# EAGLE design stepper-motor-driver (EAGLE 5.10)
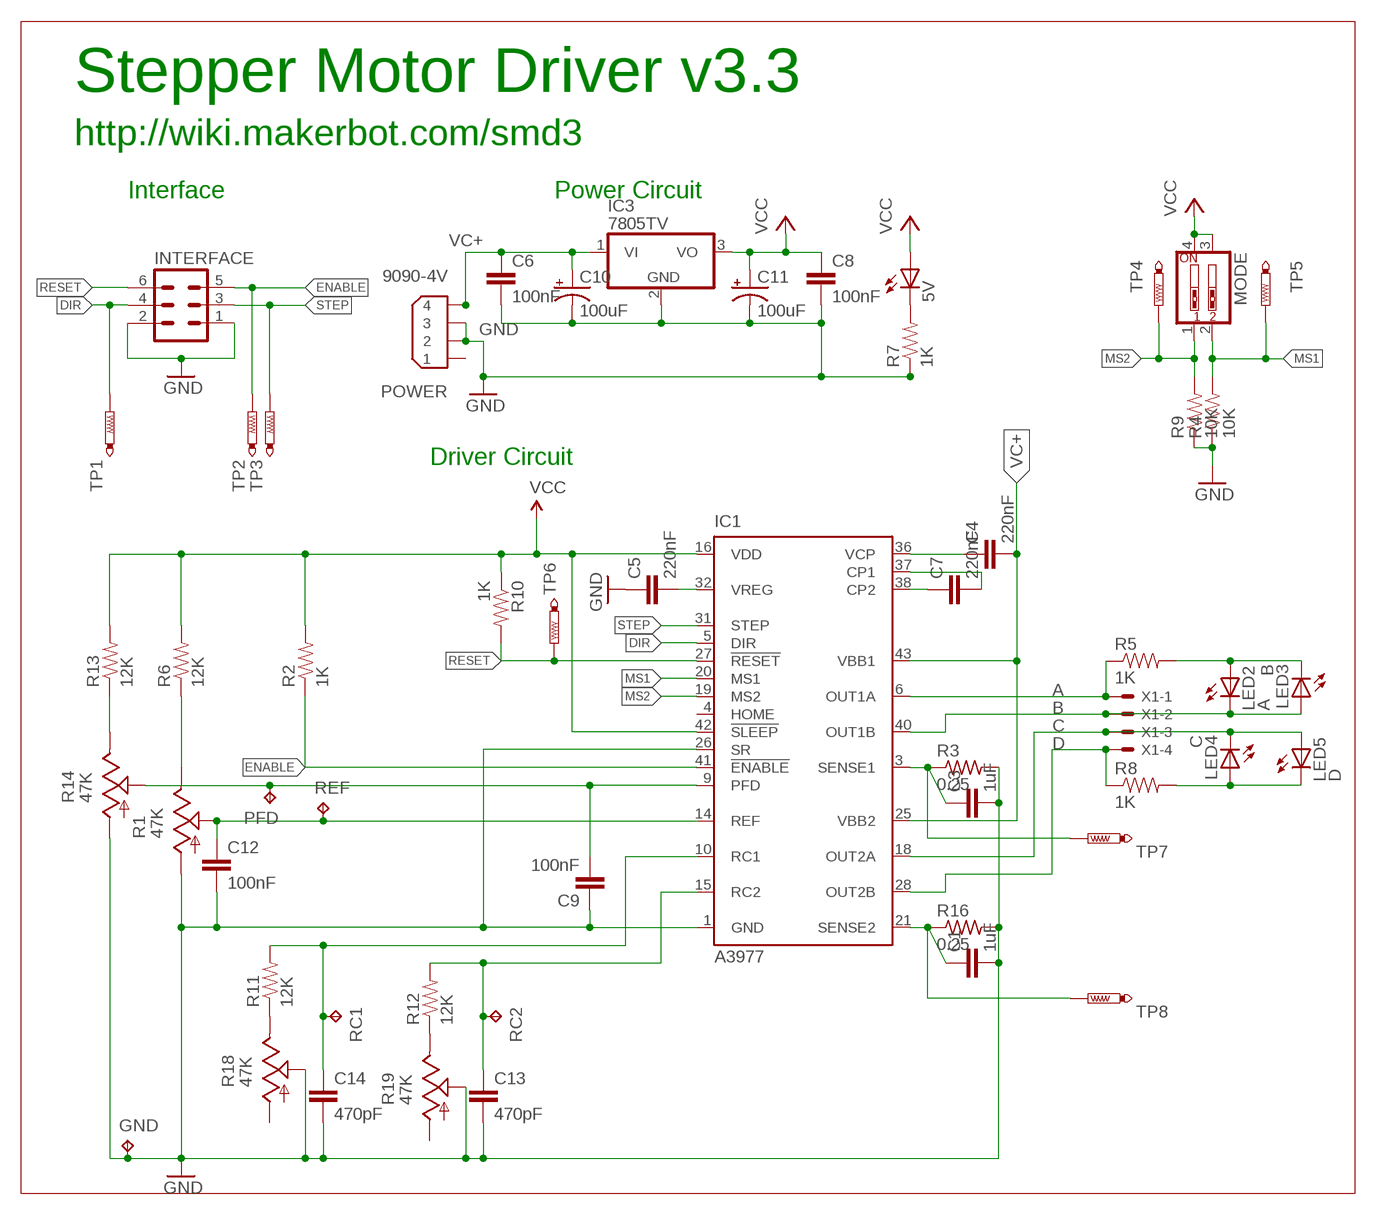
[diagram p0: schematic, sheet 1]

## Parts
5V  LED0805  [LED-0805]
C1  1uF  CAP0805  [0805]
C3  1uF  CAP0805  [0805]
C4  220nF  CAP0805  [0805]
C5  220nF  CAP0805  [0805]
C6  100nF  CAP0805  [0805]
C7  220nF  CAP0805  [0805]
C8  100nF  CAP0805  [0805]
C9  100nF  CAP0805  [0805]
C10  100uF  CPOL-USE3.5-8  [E3,5-8]
C11  100uF  CPOL-USE3.5-8  [E3,5-8]
C12  100nF  CAP0805  [0805]
C13  470pF  CAP0805  [0805]
C14  470pF  CAP0805  [0805]
GND  TPPAD1-13  [P1-13]
IC1  A3977  [PLCC44]
IC3  7805TV  [TO220V]
INTERFACE  ML6  [ML6]
LED2  A  LED0805  [LED-0805]
LED3  B  LED0805  [LED-0805]
LED4  C  LED0805  [LED-0805]
LED5  D  LED0805  [LED-0805]
MODE  SW_DIP-2  [EDG-02]
PFD  TPPAD1-13  [P1-13]
POWER  9090-4V  [9090-4V]
R1  47K  TRIM_US-B25P  [B25P]
R2  1K  RESISTOR  [0805]
R3  0.25  R-US_R2512  [R2512]
R4  10K  RESISTOR  [0805]
R5  1K  RESISTOR  [0805]
R6  12K  RESISTOR  [0805]
R7  1K  RESISTOR  [0805]
R8  1K  RESISTOR  [0805]
R9  10K  RESISTOR  [0805]
R10  1K  RESISTOR  [0805]
R11  12K  RESISTOR  [0805]
R12  12K  RESISTOR  [0805]
R13  12K  RESISTOR  [0805]
R14  47K  TRIM_US-B25P  [B25P]
R16  0.25  R-US_R2512  [R2512]
R18  47K  TRIM_US-B25P  [B25P]
R19  47K  TRIM_US-B25P  [B25P]
RC1  TPPAD1-13  [P1-13]
RC2  TPPAD1-13  [P1-13]
REF  TPPAD1-13  [P1-13]
TP1  PTR1TP09R  [TP09R]
TP2  PTR1TP09R  [TP09R]
TP3  PTR1TP09R  [TP09R]
TP4  PTR1TP09R  [TP09R]
TP5  PTR1TP09R  [TP09R]
TP6  PTR1TP09R  [TP09R]
TP7  PTR1TP09R  [TP09R]
TP8  PTR1TP09R  [TP09R]
X1  KK-156-4  [KK-156-4]

## Nets
A [Power]: IC1.6(OUT1A) R5.1 X1.1
B [Power]: IC1.40(OUT1B) LED2.C LED3.A X1.2
C [Power]: IC1.18(OUT2A) LED4.C LED5.A X1.3
D [Power]: IC1.28(OUT2B) R8.1 X1.4
DIR: IC1.5(DIR) INTERFACE.4 TP1.TP
ENABLE: IC1.41(!ENABLE) INTERFACE.5 R2.1 TP2.TP
GND [Power]: C1.2 C3.2 C5.1 C6.2 C8.2 C9.1 C10.- C11.- C12.2 C13.2 C14.2 GND.TP IC1.1(GND) IC1.26(SR) IC3.2(GND) INTERFACE.1 INTERFACE.2 POWER.2 POWER.3 R1.A R3.2 R4.1 R7.1 R9.1 R14.A R16.2 R18.S R19.S
MS1: IC1.20(MS1) MODE.2 R4.2 TP5.TP
MS2: IC1.19(MS2) MODE.1 R9.2 TP4.TP
N$1: C3.1 IC1.3(SENSE1) R3.1 TP7.TP
N$2: C1.1 IC1.21(SENSE2) R16.1 TP8.TP
N$3: C9.2 IC1.9(PFD) PFD.TP R14.S
N$4: C14.1 IC1.10(RC1) R11.2 RC1.TP
N$5: C13.1 IC1.15(RC2) R12.2 RC2.TP
N$6: R1.E R6.1
N$7: C5.2 IC1.32(VREG)
N$8: 5V.C R7.2
N$9: R13.1 R14.E
N$10 [Power]: LED2.A LED3.C R5.2
N$11: C7.1 IC1.38(CP2)
N$12 [Power]: LED4.A LED5.C R8.2
N$13: C12.1 IC1.14(REF) R1.S REF.TP
N$15: C7.2 IC1.37(CP1)
N$16: C4.1 IC1.36(VCP)
N$18: R11.1 R18.E
N$19: R12.1 R19.E
RESET: IC1.27(!RESET) INTERFACE.6 R10.2 TP6.TP
STEP: IC1.31(STEP) INTERFACE.3 TP3.TP
VC+ [Power]: C4.2 C6.1 C10.+ IC1.25(VBB2) IC1.43(VBB1) IC3.1(VI) POWER.4
VCC: 5V.A C8.1 C11.+ IC1.16(VDD) IC1.42(!SLEEP) IC3.3(VO) MODE.3 MODE.4 R2.2 R6.2 R10.1 R13.2
Unconnected: IC1.4(HOME) POWER.1 R18.A R19.A

## Notes on the sheet
- Stepper Motor Driver v3.3
- http://wiki.makerbot.com/smd3
- Interface | Power Circuit
- Driver Circuit

## Power pins joined to a net without a drawn wire
GND: IC1.2(GND) IC1.11(GND) IC1.12(GND) IC1.13(GND) IC1.22(GND) IC1.23(GND) IC1.24(GND) IC1.33(GND) IC1.34(GND) IC1.35(GND) IC1.44(GND)

## Library data of the parts
5V LED2-LED5 = SparkFun:LED: LEDs Standard schematic elements and footprints for 5mm, 3mm, 1206, and 0603 sized LEDs. 5mm - Spark Fun Electronics SKU : COM-00529 (and others)
C1 C3-C9 C12-C14 = SparkFun:CAP: Capacitor Standard 0603 ceramic capacitor, and 0.1" leaded capacitor.
C10 C11 = rcl:CPOL-US: POLARIZED CAPACITOR, American symbol
GND PFD RC1 RC2 REF = testpad:TP: Test pad
IC1 = linear:A3977: MICROSTEPPING DMOS DRIVER WITH TRANSLATOR Source: http://allegromicro.com/datafile/3977.pdf
IC3 = linear:78*: Positive VOLTAGE REGULATOR Source: http://cache.national.com/ds/LM/LM78L05.pdf http://www.fairchildsemi.com/ds/LM/LM7805.pdf
INTERFACE = con-ml:ML6: HARTING
MODE = special:SW_DIP-2: DIP SWITCH
POWER = con-thomas-betts:9090-4: Disk Drive Power four position Source: Thomas & Betts Electronic Interconnects Eiropean Edition 1998
R1 R14 R18 R19 = reprap:TRIM_US-: POTENTIOMETER
R2 R4-R13 = SparkFun:RESISTOR: Resistor Basic schematic elements and footprints for 0603, 1206, and PTH 1/10th watt (small) resistors.
R3 R16 = rcl:R-US_: RESISTOR, American symbol
TP1-TP8 = testpad:PTR1: TEST PIN
X1 = con-molex:KK-156-4: KK 156 HEADER Source: http://www.molex.com/pdm_docs/sd/026604100_sd.pdf

## Net classes
0 default: width 0.381 mm
1 Power: width 0.635 mm, drill 0.381 mm, clearance 0.508 mm
2 Trunk: width 1.676 mm, clearance 0.508 mm

## Board
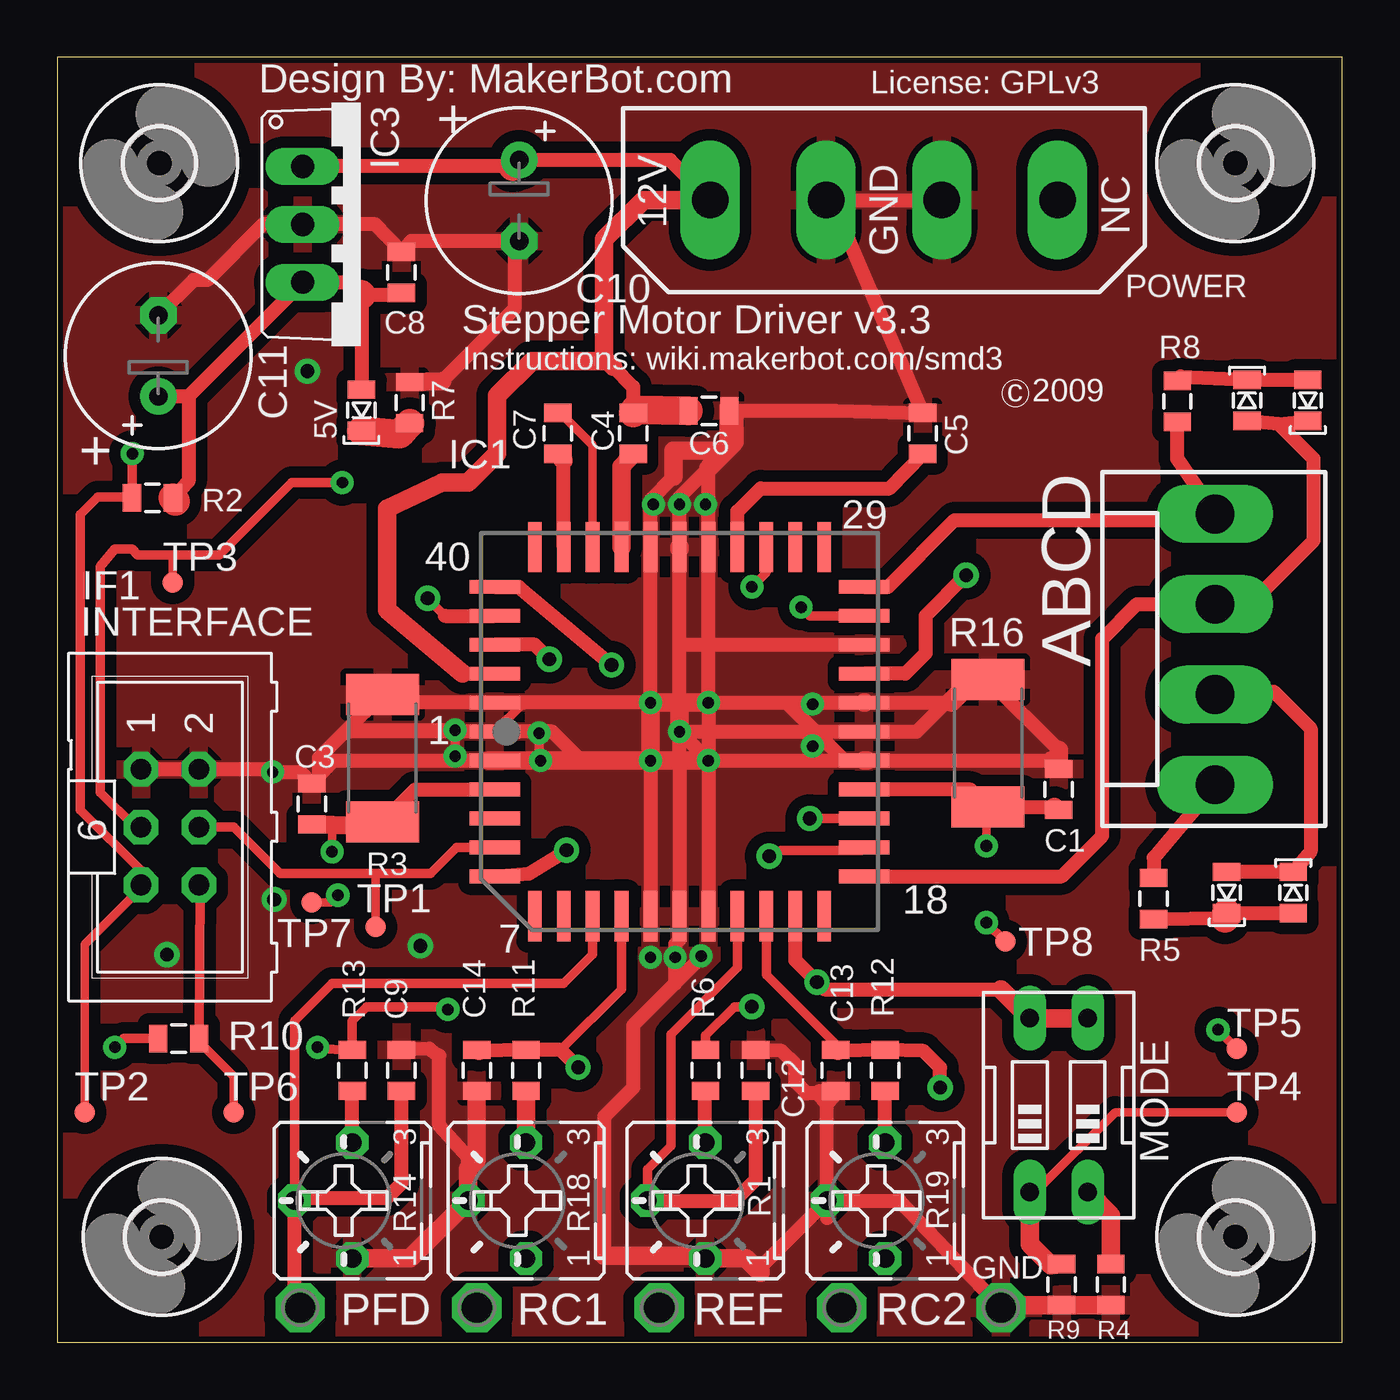
[diagram p1: board, top side]
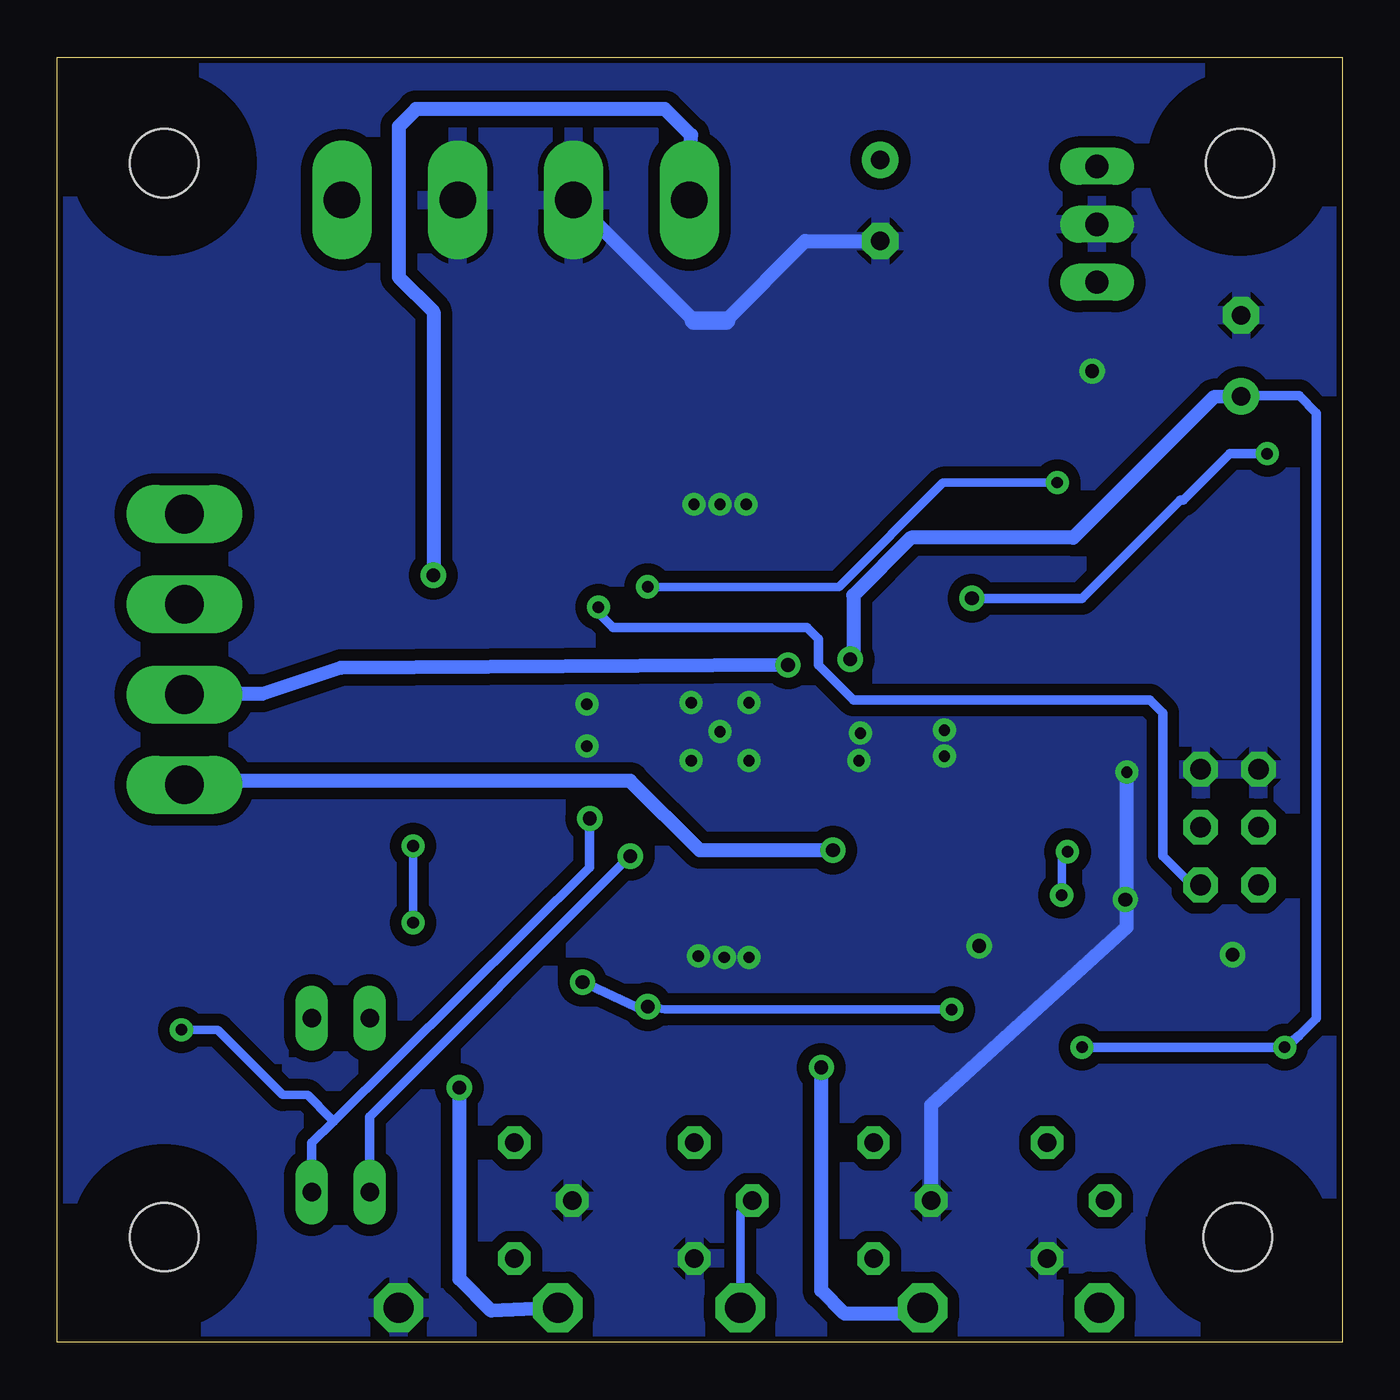
[diagram p2: board, bottom side, seen from below]

Size 56.39 x 56.39 mm. Coordinates in mm from the lower left corner, seen from the top.
Outline: 0,0 56.39,0 56.39,56.39 0,56.39 0,0
Copper layers (1*16): Top 0.035mm / dielectric 1.5mm / Bottom 0.035mm
Design rules "SparkFun": minimum track width 8mil, minimum drill 20mil, track to track 8mil, track to pad 8mil, pad to pad 8mil, via to via 8mil, smd to smd 8mil, copper to edge 10mil, drill to drill 8mil, minimum pad ring 12mil, minimum via ring 10mil, stop-mask expansion 4mil, vias tented up to drill 25mil, thermal gap 10mil

### Footprints (pad centres in the part's own frame; a part is rotated, then mirrored left to right if it is on the bottom)
LED-0805 = smd 1.2 x 0.8: A 0,-0.9; C 0,0.9
0805 = smd 0.8 x 1.2: 1 -0.9,0; 2 0.9,0
E3,5-8 = drill 0.813 pad 1.6 round: + -1.778,0 | drill 0.813 pad 1.6 octagon: - 1.778,0
P1-13 = drill 1.321 pad 2.159 octagon: TP 0,0
PLCC44 = smd 0.6 x 2.2: 1 0,8.1; 2 -1.27,8.1; 3 -2.54,8.1; 4 -3.81,8.1; 5 -5.08,8.1; 6 -6.35,8.1; 18 -6.35,-8.1; 19 -5.08,-8.1; 20 -3.81,-8.1; 21 -2.54,-8.1; 22 -1.27,-8.1; 23 0,-8.1; 24 1.27,-8.1; 25 2.54,-8.1; 26 3.81,-8.1; 27 5.08,-8.1; 28 6.35,-8.1; 40 6.35,8.1; 41 5.08,8.1; 42 3.81,8.1; 43 2.54,8.1; 44 1.27,8.1 | smd 2.2 x 0.6: 7 -8.1,6.35; 8 -8.1,5.08; 9 -8.1,3.81; 10 -8.1,2.54; 11 -8.1,1.27; 12 -8.1,0; 13 -8.1,-1.27; 14 -8.1,-2.54; 15 -8.1,-3.81; 16 -8.1,-5.08; 17 -8.1,-6.35; 29 8.1,-6.35; 30 8.1,-5.08; 31 8.1,-3.81; 32 8.1,-2.54; 33 8.1,-1.27; 34 8.1,0; 35 8.1,1.27; 36 8.1,2.54; 37 8.1,3.81; 38 8.1,5.08; 39 8.1,6.35
TO220V = drill 1.016 long: 1 -2.54,-2.54; 2 0,-2.54; 3 2.54,-2.54
ML6 = drill 0.914 octagon: 1 -2.54,-1.27; 2 -2.54,1.27; 3 0,-1.27; 4 0,1.27; 5 2.54,-1.27; 6 2.54,1.27
EDG-02 = drill 0.813 long: 1 -1.27,-3.81; 2 1.27,-3.81; 3 1.27,3.81; 4 -1.27,3.81
9090-4V = drill 1.6 pad 2.6 long: 1 -7.62,0; 2 -2.54,0; 3 2.54,0; 4 7.62,0
B25P = drill 0.813 octagon: A -2.54,0; E 2.54,0; S 0,2.54
R2512 = smd 1.8 x 3.2: 1 -2.8,0; 2 2.8,0
TP09R = smd 0.9 x 0.9: TP 0,0
3,0 = hole 3: 0,0
KK-156-4 = drill 1.7 pad 2.184 long: 1 -5.94,0; 2 -1.98,0; 3 1.98,0; 4 5.94,0

### Placement (x,y rotation side)
5V  13.36,40.9 180 top
C1  43.94,24.26 90 top
C3  11.18,23.62 90 top
C4  25.27,39.88 90 top
C5  37.97,39.88 270 top
C6  28.6,40.87 0 top
C7  21.97,39.88 90 top
C8  15.11,46.94 90 top
C9  15.11,11.94 270 top
C10  20.27,50.09 270 top
C11  4.45,43.28 90 top
C12  30.65,11.94 90 top
C13  34.16,11.94 270 top
C14  18.41,11.94 270 top
GND  41.4,1.52 0 top
IC1  27.3,26.8 90 top
IC3  13.31,49.05 270 top
INTERFACE  4.95,22.61 270 top
LED2  54.23,19.74 0 top
LED3  51.31,19.74 180 top
LED4  54.86,41.33 180 top
LED5  52.2,41.33 0 top
MODE  43.94,10.41 0 top
PFD  10.67,1.52 0 top
POWER  36.27,50.11 180 top
R1  28.43,6.22 90 top
R2  4.19,37.06 0 top
R3  14.27,25.63 90 top
R4  46.23,2.54 90 top
R5  48.1,19.47 270 top
R6  28.45,11.94 90 top
R7  15.47,41.22 270 top
R8  49.14,41.29 90 top
R9  44.07,2.54 90 top
R10  5.33,13.34 0 top
R11  20.57,11.94 90 top
R12  36.32,11.94 90 top
R13  12.95,11.94 90 top
R14  12.95,6.22 90 top
R16  40.84,26.29 90 top
R18  20.57,6.22 90 top
R19  36.32,6.22 90 top
RC1  18.41,1.52 0 top
RC2  34.42,1.52 0 top
REF  26.42,1.52 0 top
TP1  13.97,18.22 0 top
TP2  1.21,10.1 0 top
TP3  5.08,33.34 0 top
TP4  51.75,10.1 0 top
TP5  51.75,12.89 0 top
TP6  7.75,10.1 0 top
TP7  11.18,19.3 0 top
TP8  41.59,17.59 0 top
U$1  [3,0]  4.49,51.73 0 top
U$2  [3,0]  51.69,51.73 0 top
U$3  [3,0]  4.59,4.63 0 top
U$4  [3,0]  51.69,4.63 0 top
X1  50.8,30.4 90 top

### Tracks (layer width: path | path; a pad name or v marks a point on that pad's centre or on a via)
A  (via drill 0.6)
  Top 0.61: R5.1 48.1,21.26 X1.1 | IC1.6 20.7,20.57 v22.35,21.59
  Bottom 0.61: v22.35,21.59 28.19,21.59 31.24,24.64 50.63,24.64 X1.1
B  (via drill 0.6)
  Top 0.61: LED3.A LED2.C 54.99,21.55 54.99,26.92 53.36,28.55 X1.2 | IC1.40 20.26,33.15 v24.32,29.72
  Bottom 0.61: v24.32,29.72 43.94,29.59 47.37,28.45 50.78,28.45
  Bottom 0.813: 50.78,28.45 X1.2
C
  Top 0.61: 53.59,40.28 LED5.A | 53.59,40.28 LED4.C | X1.3 52.45,32.51 55.12,35.18 55.12,38.75 53.59,40.28 | IC1.18 44.07,20.45 45.85,22.23 45.85,30.86 47.37,32.38 X1.3
  Top 0.813: X1.3
D
  Top 0.61: R8.1 49.14,38.77 X1.4 | IC1.28 36.45,33.15 39.37,36.07 50.52,36.07
  Top 0.813: 50.52,36.07 X1.4
DIR
  Top 0.381: 13.97,20.57 TP1.TP
  Top 0.406: INTERFACE.4 7.75,22.61 9.78,20.57 13.97,20.57 16.38,20.57 17.53,21.72 IC1.5
ENABLE  (via drill 0.5, 0.6)
  Top 0.381: TP2.TP 1.21,17.46 3.62,19.88 INTERFACE.5
  Top 0.406: INTERFACE.5 3.68,20.7 1.02,23.37 1.02,36.32 1.78,37.08 3.32,37.08 R2.1 3.3,37.1 v3.3,38.99 | v16.26,32.64 17.02,31.88
  Top 0.61: 17.02,31.88 IC1.41
  Bottom 0.406: v16.26,32.64 11.43,32.64 7.11,36.96 6.99,36.96 4.95,38.99 v3.3,38.99
GND  (via drill 0.5, 0.6, 0.6 pad 0)
  Top 0.406: v9.46,25.02 9.34,25.15 | 20.45,28.07 20.45,28.04 IC1.1 | 21.72,26.8 21.21,26.8 v21.14,26.73 21.14,25.59 v21.21,25.53 | v17.46,26.86 v17.46,25.72
  Top 0.61: C11.- 5.99,46.61 6.6,46.61 9.04,49.05 IC3.2 13.96,49.05 C8.2 15.54,48.31 C10.- 20.07,48.11 20.07,45.34 16.9,42.17 | R19.S 33.78,5.46 | R19.S 36.96,6.22 GND.TP | R19.S 33.78,10.61 | POWER.3 POWER.2 | 27.3,25.65 27.3,26.67 27.18,26.8 | 27.3,28.07 27.3,30.61 | v26.04,28.07 IC1.35 26.04,36.96 27.05,37.97 | v26.04,25.53 IC1.11 | v28.57,25.53 v28.57,28.07 IC1.33 28.57,38.35 | v28.57,25.53 IC1.13 | v26.04,28.07 20.45,28.07 IC1.44 14.64,28.07 | 27.43,26.8 IC1.23 37.72,26.8 40.01,29.09 | 27.3,30.61 IC1.26 | R16.2 43.94,25.99 | R3.2 12.64,26.8 IC1.1 21.72,26.8 22.99,25.53 | 34.16,49.68 C5.1 34.16,40.87 C6.2 | C9.1 16.32,12.89 16.76,12.57 16.76,9.53 18.03,8.13 18.03,6.73 | C12.2 31.79,12.79 32.38,12.19 32.38,11.43 32.89,10.92 33.47,10.92 | 30.86,3.3 R19.S | v28.57,25.53 v27.3,26.8 | C3.2 12.13,25.53 18.92,25.53 19.3,25.53 | 39.24,28.07 35.43,28.07 32,28.07 | 43.62,25.53 35.56,25.53 34.54,25.53 | 29.46,39.24 27.3,37.08 27.3,34.8 27.3,30.61 | v26.04,28.07 32,28.07 | v21.21,25.53 27.3,25.53 IC1.12 27.3,17.65 27.11,17.46 v27.11,16.89 27.11,15.75 | 27.43,25.53 34.54,25.53 | 32,28.07 34.54,25.53 | 24,3.81 24,9.91 25.27,11.18 25.27,13.91 27.11,15.75 | INTERFACE.1 INTERFACE.2 9.34,25.15 | v17.46,26.86 12.7,26.86 11.49,25.65 11.49,24.84 C3.2 | v9.46,25.02 10.68,25.02 C3.2 | v28.26,16.95 28.26,16.89 27.11,15.75
  Top 0.813: 24,3.81 28.31,3.81 R1.A 30.23,3.68 30.86,3.05 30.86,3.3 | R4.1 R9.1 41.52,1.64 GND.TP | C13.2 33.78,10.61 33.47,10.92 | C14.2 18.41,8 18.03,7.62 18.03,6.73 R18.S 15.49,3.68 R14.A | 27.3,25.53 27.3,25.65 27.43,25.53 | 27.3,26.92 v27.3,26.8 27.3,26.67 | 27.3,28.07 27.3,26.92 | 27.3,34.8 IC1.34 | v26.04,28.07 v26.04,25.53 v21.21,25.53 19.3,25.53 | v26.04,28.07 27.3,28.07 | 27.3,28.07 v28.57,28.07 v26.04,28.07 | 27.3,26.92 27.43,26.8 | 40.26,29.09 40.01,29.09 | 40.26,29.09 R16.2 | 43.94,25.99 C1.2 43.62,25.53 | 14.64,28.07 R3.2 | 34.16,49.68 POWER.3 | 28.57,38.35 29.21,38.99 | 29.21,38.99 29.59,39.37 | 29.59,39.37 29.59,40.77 | 29.59,40.77 29.59,40.83 C6.2 | 16.9,42.17 R7.1 | 18.92,25.53 IC1.2 | 35.43,28.07 IC1.24 | 39.24,28.07 40.26,29.09 | 35.56,25.53 IC1.22 | 27.05,37.97 27.05,39.12 29.08,39.12 29.21,38.99 | 29.59,39.37 29.72,39.5 29.72,40.64 29.59,40.77 | 29.46,41.02 29.46,40.89 29.59,40.77 | 29.59,40.77 29.46,40.77 29.46,39.24 | 27.3,25.53 22.99,25.53 | 27.3,25.53 27.43,25.53 | 27.43,25.53 v28.57,25.53
  Bottom 0.61: R18.S 18.03,10.41 9.46,18.22 v9.46,25.02 | C10.- 23.57,48.31 27.05,44.83 | POWER.3 28.45,44.83
  Bottom 0.813: 28.45,44.83 27.05,44.83
  other vias: 33.15,28 33.15,26.16 28.45,36.77 27.3,36.77 26.16,36.77 26.04,16.89 9.53,19.43 4.83,17.02 15.94,17.4 10.99,42.61
  pour Top: -1.27,57.91 59.69,57.91 59.69,-0.51 -1.27,-0.51
  pour Bottom: -1.27,57.91 59.69,57.91 59.69,-0.51 -1.27,-0.51
MS1  (via drill 0.51, 0.6)
  Top 0.381: v50.93,13.72 TP5.TP
  Top 0.406: v33.02,22.99 IC1.20
  Top 0.813: R4.2 46.23,5.59 MODE.2
  Bottom 0.381: v50.93,13.72 49.34,13.72 46.48,10.86 45.4,10.86 44.39,9.84 44.26,9.71
  Bottom 0.406: MODE.2 45.21,8.76 44.26,9.71 33.02,20.83 v33.02,22.99
MS2  (via drill 0.6)
  Top 0.381: TP4.TP 46.42,10.1 43.05,6.73 MODE.1
  Top 0.406: v31.24,21.34 31.75,21.59 35.28,21.59 IC1.19
  Top 0.813: R9.2 43.6,3.39 42.67,4.32 MODE.1
  Bottom 0.406: MODE.1 42.67,9.91 v31.24,21.34
N$1  (via drill 0.51)
  Top 0.381: TP7.TP 12,19.3 v12.32,19.62 | v12.06,21.53 12.06,22.35 12.07,22.71
  Top 0.61: IC1.3 15.7,24.26 R3.1
  Top 0.813: C3.1 12.07,22.71 14.12,22.67 R3.1
  Bottom 0.381: v12.32,19.62 12.32,21.27 v12.06,21.53
N$2  (via drill 0.51)
  Top 0.381: TP8.TP v40.77,18.41 | v40.77,21.78 40.77,23.24 R16.1
  Top 0.61: IC1.21 40.08,24.26 R16.1 43.76,23.49
  Top 0.813: 43.76,23.49 C1.1
  Bottom 0.381: v40.77,18.41 v40.77,21.78
N$3
  Top 0.406: R14.S 10.41,14.1 12.06,15.75 22.23,15.75 23.5,17.02 IC1.9
  Top 0.61: 10.41,1.78 R14.S | C9.2 15.11,6.99 14.48,6.35 10.54,6.35
  Top 0.813: PFD.TP 10.41,1.78 | R14.S 10.54,6.35
N$4  (via drill 0.6)
  Top 0.406: IC1.10 24.77,15.49 22.1,12.83
  Top 0.61: v22.86,12.06 22.1,12.83 20.61,12.83 | R11.2 18.52,12.79
  Top 0.813: 20.61,12.83 R11.2 | 18.52,12.79 C14.1
  Bottom 0.61: v22.86,12.06 22.86,2.29 21.84,1.27 18.54,1.27
  Bottom 0.813: RC1.TP 18.54,1.27
N$5  (via drill 0.6)
  Top 0.406: C13.1 34.16,13.08 31.11,16.13 IC1.15
  Top 0.61: 34.26,12.79 R12.2 38.01,12.79 38.73,12.06 v38.73,11.18
  Top 0.813: 34.26,12.79 C13.1
  Bottom 0.61: v38.73,11.18 38.73,2.79 37.34,1.4 RC2.TP
N$6
  Top 0.61: R1.E 28.43,10.97
  Top 0.813: 28.43,10.97 R6.1
N$7
  Top 0.61: IC1.32 29.84,36.45 30.86,37.47 36.51,37.47 C5.2
N$8
  Top 1.27: 5V.C 15.04,39.85 R7.2
N$9
  Top 0.61: R14.E R13.1
N$10
  Top 0.61: R5.2 51.24,18.62 | LED3.C LED2.A
  Top 1.27: 51.24,18.62 LED3.C
N$11
  Top 0.61: IC1.38 22.23,38.67
  Top 0.813: 22.23,38.67 C7.1
N$12
  Top 0.61: LED4.A LED5.C 49.28,42.38 R8.2
N$13
  Top 0.406: R1.S 25.89,7.61 26.92,8.64 26.92,13.53 29.84,16.45 IC1.14
  Top 0.61: C12.1 30.65,7.16 29.72,6.22 R1.S
  Bottom 0.381: REF.TP 26.42,5.71 25.91,6.22 R1.S
N$15
  Top 0.381: C7.2 21.97,40.77 22.1,40.77 23.5,39.37 IC1.37
N$16
  Top 0.813: IC1.36 24.77,38.42 C4.1
N$18
  Top 0.813: R18.E R11.1
N$19
  Top 0.61: R19.E R12.1
RESET  (via drill 0.5)
  Top 0.381: TP6.TP 7.75,11.68 6.29,13.14 R10.2
  Top 0.406: IC1.27 33.02,31.88 v32.64,32.26 | R10.2 6.28,20 INTERFACE.6
  Bottom 0.406: v32.64,32.26 32.64,32 32,31.37 23.5,31.37 22.99,30.86 22.99,29.72 21.46,28.19 8.45,28.19 7.87,27.62 7.87,21.34 6.6,20.07 INTERFACE.6
STEP  (via drill 0.5, 0.51)
  Top 0.381: v30.48,33.15 31.11,33.78 IC1.31 | 5.08,34.54 TP3.TP
  Top 0.406: INTERFACE.3 3.43,22.61 1.91,24.13 1.91,34.04 2.54,34.8 3.29,34.8 3.55,34.54 5.08,34.54 7.11,34.54 10.29,37.72 v12.51,37.72
  Bottom 0.381: v30.48,33.15 22.1,33.15 17.53,37.72 v12.51,37.72
VC+  (via drill 0.6)
  Top 0.61: 19.99,51.59 IC3.1 | C10.+ 26.9,51.87 POWER.4 | C4.2 25.27,41.91 24.38,42.8 24,43.18 | 17.78,29.34 IC1.43 | IC1.25 37.21,29.34 38.1,30.23 38.1,31.88 v39.88,33.66
  Top 0.813: 24.38,42.8 24.13,43.05 20.83,43.05 19.3,41.53 19.3,38.99 18.03,37.72 16.89,37.72 14.48,36.58 14.48,32.13 17.78,29.34 | POWER.4 25.73,50.11 24,48.39 24,43.18
  Top 1.27: C10.+ 19.99,51.59 | C6.1 25.38,40.93 C4.2
  Bottom 0.61: v39.88,33.66 39.88,45.21 41.4,46.74 41.4,53.34 40.64,54.1 29.72,54.1 28.57,52.96 28.57,50.19 POWER.4
VCC  (via drill 0.5, 0.51, 0.6)
  Top 0.381: R13.2 12.95,12.89
  Top 0.406: v17.14,14.61 17.02,14.73 13.59,14.73 12.95,14.1 R13.2 11.37,12.89 v11.43,12.95 | R10.1 2.92,13.34 v2.54,12.95 | v30.48,14.73 29.72,14.73 28.45,13.46 R6.2
  Top 0.61: C8.1 15.1,45.97 13.34,45.97 12.8,46.51 IC3.3 5.77,41.5 | 13.36,45.95 5V.A | IC1.16 32.38,16.76 v33.34,15.81 33.66,15.49 41.4,15.49 | IC1.42 20.95,30.61 v21.59,29.97 | C11.+ 5.77,41.5 | 5.77,41.5 5.77,37.78 R2.2
  Top 0.813: 41.4,15.49 MODE.4 MODE.3
  Top 1.27: 13.34,45.97 13.36,45.95 | R2.2 5.19,36.91
  Bottom 0.381: v17.14,14.61 29.72,14.61 v30.48,14.73
  Bottom 0.406: v30.48,14.73 30.99,14.73 v33.34,15.81 | 1.91,13.46 1.14,14.22 1.14,40.77 1.91,41.53 4.42,41.53 C11.+ | 1.91,13.46 2.41,12.95 v2.54,12.95 | v2.54,12.95 v11.43,12.95 | 1.91,13.46 v2.54,12.95
  Bottom 0.61: v21.59,29.97 21.46,30.1 21.46,32.77 18.92,35.31 11.81,35.31 5.65,41.47 4.72,41.5 C11.+

### Text on the board
tPlace: Design By: MakerBot.com | License: GPLv3 | 12V | GND | NC | Stepper Motor Driver v3.3 | Instructions: wiki.makerbot.com/smd3 | c 2009 | IF1 | INTERFACE | ABCD
_tsilk: + | POWER | + | 29 | 40 | 1 | 18 | 7